# EAGLE schematic sd2_redraw (EAGLE 8.5.1)
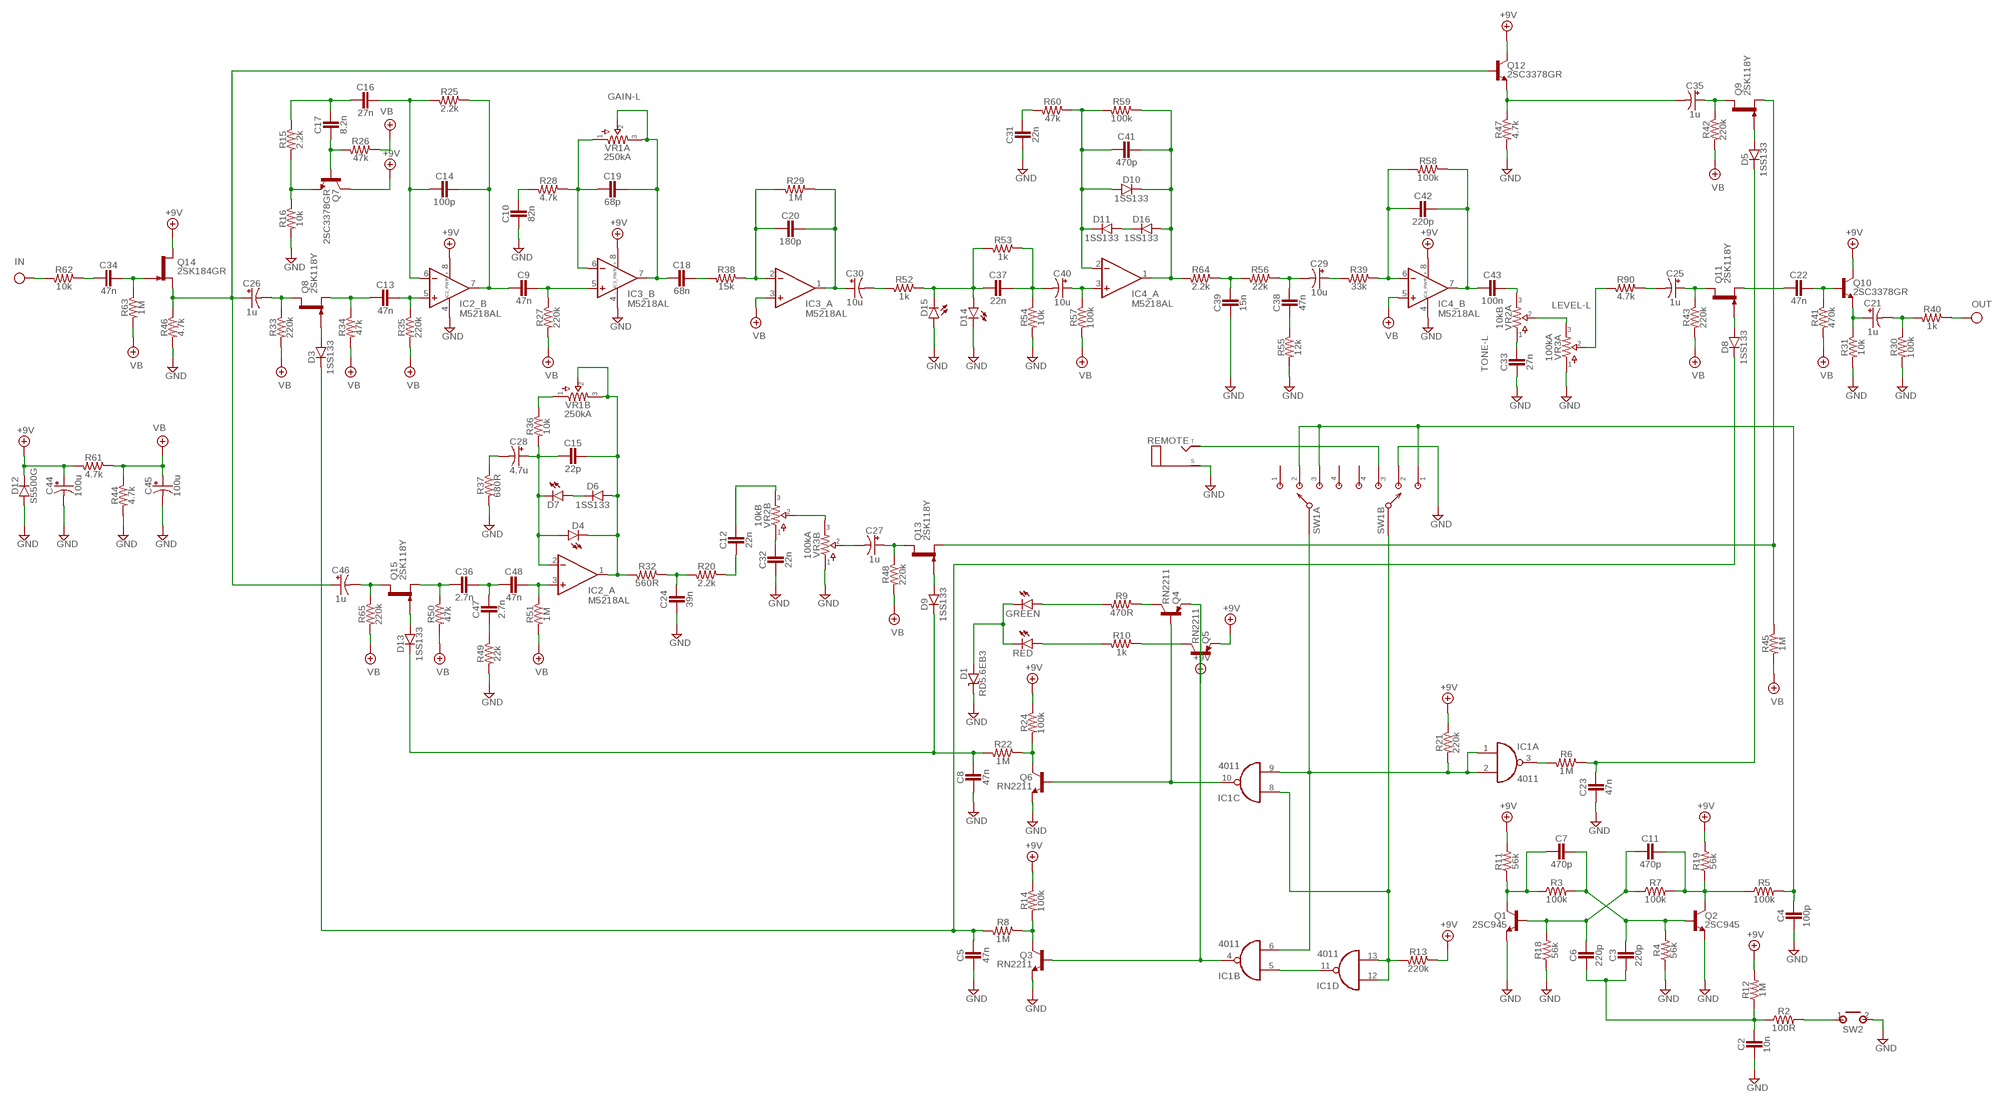
[diagram p0: schematic, sheet 1]

## Parts
C2  10n  CER/FILMBOX.1  [BOX_SMALL]
C3  220p  CER/FILMBOX.1  [BOX_SMALL]
C4  100p  CER/FILMBOX.1  [BOX_SMALL]
C5  47n  CER/FILMBOX.1  [BOX_SMALL]
C6  220p  CER/FILMBOX.1  [BOX_SMALL]
C7  470p  CER/FILMBOX.1  [BOX_SMALL]
C8  47n  CER/FILMBOX.1  [BOX_SMALL]
C9  47n  CER/FILMBOX.1  [BOX_SMALL]
C10  82n  CER/FILMBOX.1  [BOX_SMALL]
C11  470p  CER/FILMBOX.1  [BOX_SMALL]
C12  22n  CER/FILMBOX.1  [BOX_SMALL]
C13  47n  CER/FILMBOX.1  [BOX_SMALL]
C14  100p  CER/FILMBOX.1  [BOX_SMALL]
C15  22p  CER/FILMBOX.1  [BOX_SMALL]
C16  27n  CER/FILMBOX.1  [BOX_SMALL]
C17  8.2n  CER/FILMBOX.1  [BOX_SMALL]
C18  68n  CER/FILMBOX.1  [BOX_SMALL]
C19  68p  CER/FILMBOX.1  [BOX_SMALL]
C20  180p  CER/FILMBOX.1  [BOX_SMALL]
C21  1u  0400  [040_020]
C22  47n  CER/FILMBOX.1  [BOX_SMALL]
C23  47n  CER/FILMBOX.1  [BOX_SMALL]
C24  39n  CER/FILMBOX.1  [BOX_SMALL]
C25  1u  0400  [040_020]
C26  1u  0400  [040_020]
C27  1u  0400  [040_020]
C28  4.7u  0400  [040_020]
C29  10u  0400  [040_020]
C30  10u  0400  [040_020]
C31  22n  CER/FILMBOX.1  [BOX_SMALL]
C32  22n  CER/FILMBOX.1  [BOX_SMALL]
C33  27n  CER/FILMBOX.1  [BOX_SMALL]
C34  47n  CER/FILMBOX.1  [BOX_SMALL]
C35  1u  0400  [040_020]
C36  2.7n  CER/FILMBOX.1  [BOX_SMALL]
C37  22n  CER/FILMBOX.1  [BOX_SMALL]
C38  47n  CER/FILMBOX.1  [BOX_SMALL]
C39  15n  CER/FILMBOX.1  [BOX_SMALL]
C40  10u  0400  [040_020]
C41  470p  CER/FILMBOX.1  [BOX_SMALL]
C42  220p  CER/FILMBOX.1  [BOX_SMALL]
C43  100n  CER/FILMBOX.1  [BOX_SMALL]
C44  100u  0400  [040_020]
C45  100u  0400  [040_020]
C46  1u  0400  [040_020]
C47  2.7n  CER/FILMBOX.1  [BOX_SMALL]
C48  47n  CER/FILMBOX.1  [BOX_SMALL]
D1  RD5.6EB3  ZENER.2  [DO41-2]
D3  1SS133  DO35.2  [DO35-2]
D4  LED  [3MM_D]
D5  1SS133  DO35.2  [DO35-2]
D6  1SS133  DO35.2  [DO35-2]
D7  LED  [3MM_D]
D8  1SS133  DO35.2  [DO35-2]
D9  1SS133  DO35.2  [DO35-2]
D10  1SS133  DO35.2  [DO35-2]
D11  1SS133  DO35.2  [DO35-2]
D12  S5500G  DO35.2  [DO35-2]
D13  1SS133  DO35.2  [DO35-2]
D14  LED  [3MM_D]
D15  LED  [3MM_D]
D16  1SS133  DO35.2  [DO35-2]
GREEN  LED  [3MM_D]
IC1  4011  4011N  [DIL14]
IC2  M5218AL  DUALTH  [DIL0]
IC3  M5218AL  DUALTH  [DIL0]
IC4  M5218AL  DUALTH  [DIL0]
Q1  2SC945  2SC828A  [TO92-]
Q2  2SC945  2SC828A  [TO92-]
Q3  RN2211  2N3904  [TO92-]
Q4  RN2211  2N3906  [TO92]
Q5  RN2211  2N3906  [TO92]
Q6  RN2211  2N3904  [TO92-]
Q7  2SC3378GR  2N3904  [TO92-]
Q8  2SK118Y  2N5457  [TO92-]
Q9  2SK118Y  2N5457  [TO92-]
Q10  2SC3378GR  2N3904  [TO92-]
Q11  2SK118Y  2N5457  [TO92-]
Q12  2SC3378GR  2N3904  [TO92-]
Q13  2SK118Y  2N5457  [TO92-]
Q14  2SK184GR  2N5457  [TO92-]
Q15  2SK118Y  2N5457  [TO92-]
R2  100R  R_.3B  [R0207/3]
R3  100k  R_.3B  [R0207/3]
R4  56k  R_.3B  [R0207/3]
R5  100k  R_.3B  [R0207/3]
R6  1M  R_.3B  [R0207/3]
R7  100k  R_.3B  [R0207/3]
R8  1M  R_.3B  [R0207/3]
R9  470R  R_.3B  [R0207/3]
R10  1k  R_.3B  [R0207/3]
R11  56k  R_.3B  [R0207/3]
R12  1M  R_.3B  [R0207/3]
R13  220k  R_.3B  [R0207/3]
R14  100k  R_.3B  [R0207/3]
R15  2.2k  R_.3B  [R0207/3]
R16  10k  R_.3B  [R0207/3]
R18  56k  R_.3B  [R0207/3]
R19  56k  R_.3B  [R0207/3]
R20  2.2k  R_.3B  [R0207/3]
R21  220k  R_.3B  [R0207/3]
R22  1M  R_.3B  [R0207/3]
R24  100k  R_.3B  [R0207/3]
R25  2.2k  R_.3B  [R0207/3]
R26  47k  R_.3B  [R0207/3]
R27  220k  R_.3B  [R0207/3]
R28  4.7k  R_.3B  [R0207/3]
R29  1M  R_.3B  [R0207/3]
R30  100k  R_.3B  [R0207/3]
R31  10k  R_.3B  [R0207/3]
R32  560R  R_.3B  [R0207/3]
R33  220k  R_.3B  [R0207/3]
R34  47k  R_.3B  [R0207/3]
R35  220k  R_.3B  [R0207/3]
R36  10k  R_.3B  [R0207/3]
R37  680R  R_.3B  [R0207/3]
R38  15k  R_.3B  [R0207/3]
R39  33k  R_.3B  [R0207/3]
R40  1k  R_.3B  [R0207/3]
R41  470k  R_.3B  [R0207/3]
R42  220k  R_.3B  [R0207/3]
R43  220k  R_.3B  [R0207/3]
R44  4.7k  R_.3B  [R0207/3]
R45  1M  R_.3B  [R0207/3]
R46  4.7k  R_.3B  [R0207/3]
R47  4.7k  R_.3B  [R0207/3]
R48  220k  R_.3B  [R0207/3]
R49  22k  R_.3B  [R0207/3]
R50  47k  R_.3B  [R0207/3]
R51  1M  R_.3B  [R0207/3]
R52  1k  R_.3B  [R0207/3]
R53  1k  R_.3B  [R0207/3]
R54  10k  R_.3B  [R0207/3]
R55  12k  R_.3B  [R0207/3]
R56  22k  R_.3B  [R0207/3]
R57  100k  R_.3B  [R0207/3]
R58  100k  R_.3B  [R0207/3]
R59  100k  R_.3B  [R0207/3]
R60  47k  R_.3B  [R0207/3]
R61  4.7k  R_.3B  [R0207/3]
R62  10k  R_.3B  [R0207/3]
R63  1M  R_.3B  [R0207/3]
R64  2.2k  R_.3B  [R0207/3]
R65  220k  R_.3B  [R0207/3]
R90  4.7k  R_.3B  [R0207/3]
RED  LED  [3MM_D]
REMOTE  MONO  [TWO_PADS]
SW1  2P4T  [SMALLROTARY]
SW2  MOMENTARY  [SPST]
VR1A  250kA  POTS16MM  [16MM]
VR1B  250kA  POTS16MM  [16MM]
VR2A  10kB  POTS16MM  [16MM]
VR2B  10kB  POTS16MM  [16MM]
VR3A  100kA  POTS16MM  [16MM]
VR3B  100kA  POTS16MM  [16MM]

## Nets
+9V: C44.+ D12.C IC2.8(_PWR:V+) IC3.8(_PWR:V+) IC4.8(_PWR:V+) Q4.3(E) Q5.3(E) Q7.1(C) Q10.1(C) Q12.1(C) Q14.3(D) R11.2 R12.2 R13.1 R14.1 R19.2 R21.1 R24.1 R61.2
GND: C2.2 C4.2 C5.2 C8.2 C10.2 C23.2 C24.2 C31.2 C32.2 C33.2 C39.2 C44.- C45.- D1.C D12.A D14.P$1(C) D15.ANODE(A) IC2.4(_PWR:V-) IC3.4(_PWR:V-) IC4.4(_PWR:V-) Q1.3(E) Q2.3(E) Q3.3(E) Q6.3(E) R4.1 R16.2 R18.1 R30.2 R31.2 R37.2 R44.2 R46.2 R47.2 R49.2 R54.2 R55.2 REMOTE.S(SLEEVE) SW1.6 SW2.2(S) VR3A.1 VR3B.1
IN: R62.2
N$1: C27.- VR3B.2
N$2: D6.C D7.ANODE(A)
N$3: C34.2 R62.1
N$4: C34.1 Q14.1(G) R63.1
N$5: C26.+ C46.+ Q12.2(B) Q14.2(S) R46.1
N$6: C26.- Q8.3(D) R33.1
N$7: D3.A Q8.1(G)
N$8: C13.2 Q8.2(S) R34.1
N$9: C13.1 IC2.5(_B:+IN) R35.1
N$10: C14.2 C16.1 IC2.6(_B:-IN) R25.2
N$11: C9.2 C14.1 IC2.7(_B:OUT) R25.1
N$12: Q7.3(E) R15.2 R16.1
N$13: C9.1 IC3.5(_B:+IN) R27.1
N$14: C17.2 Q7.2(B) R26.2
N$15: C10.1 R28.2
N$16: C16.2 C17.1 R15.1
N$17: IC1.10(C:O) Q4.2(B) Q6.2(B)
N$19: C18.1 R38.2
N$20: C20.2 IC3.2(_A:-IN) R29.2 R38.1
N$21: C20.1 C30.+ IC3.1(_A:OUT) R29.1
N$22: C30.- R52.2
N$23: C37.2 D14.ANODE(A) D15.P$1(C) R52.1 R53.2
N$24: C37.1 C40.- R53.1 R54.1
N$25: C40.+ IC4.3(_A:+IN) R57.1
N$26: C41.2 D10.A D11.C IC4.2(_A:-IN) R59.2 R60.1
N$28: C41.1 D10.C D16.A IC4.1(_A:OUT) R59.1 R64.2
N$29: C7.2 Q1.2(C) R3.1 R11.1
N$30: D11.A D16.C
N$31: C11.1 Q2.2(C) R5.1 R7.2 R19.1
N$32: C6.1 C11.2 Q1.1(B) R7.1 R18.2
N$33: C31.1 R60.2
N$34: C3.1 C7.1 Q2.1(B) R3.2 R4.2
N$35: C2.1 C3.2 C6.2 R2.1 R12.1
N$36: C39.1 R56.2 R64.1
N$37: C29.- C38.1 R56.1
N$38: C38.2 R55.1
N$39: C29.+ R39.2
N$40: C42.2 IC4.6(_B:-IN) R39.1 R58.2
N$41: C43.1 VR2A.3
N$42: C42.1 C43.2 IC4.7(_B:OUT) R58.1
N$43: C33.1 VR2A.1
N$44: VR2A.2 VR3A.3
N$45: R90.2 VR3A.2
N$46: C25.- R90.1
N$47: C25.+ Q11.3(D) R43.1
N$48: D8.A Q11.1(G)
N$49: C35.+ Q9.3(D) R42.1
N$50: D5.A Q9.1(G)
N$51: C35.- Q12.3(E) R47.1
N$52: C46.- Q15.3(D) R65.1
N$53: C36.2 Q15.2(S) R50.1
N$54: D13.A Q15.1(G)
N$55: C36.1 C47.1 C48.2
N$56: C47.2 R49.1
N$57: C48.1 IC2.3(_A:+IN) R51.1
N$58: C15.2 C28.+ D4.ANODE(A) D7.P$1(C) IC2.2(_A:-IN) R36.2
N$59: R36.1 VR1B.1
N$60: C15.1 D4.P$1(C) D6.A IC2.1(_A:OUT) R32.2 VR1B.2 VR1B.3
N$61: C24.1 R20.2 R32.1
N$62: C28.- R37.1
N$63: C12.2 R20.1
N$64: C12.1 VR2B.3
N$65: C32.1 VR2B.1
N$66: VR2B.2 VR3B.3
N$68: C27.+ Q13.3(D) R48.1
N$69: D9.A Q13.1(G)
N$71: Q3.1(C) R8.1 R14.2
N$72: Q5.1(C) R10.1
N$73: Q4.1(C) R9.1
N$74: GREEN.ANODE(A) R9.2
N$75: R10.2 RED.ANODE(A)
N$76: D1.A GREEN.P$1(C) RED.P$1(C)
N$77: Q6.1(C) R22.1 R24.2
N$78: C8.1 D9.C D13.C R22.2
N$79: C5.1 D3.C D8.C R8.2
N$80: IC1.4(B:O) Q3.2(B) Q5.2(B)
N$81: Q9.2(S) Q13.2(S) R45.1
N$82: IC1.1(A:I0) IC1.2(A:I1) IC1.6(B:I1) IC1.9(C:I1) R21.2 SW1.C(A:A)
N$83: IC1.5(B:I0) IC1.11(D:O)
N$84: IC1.8(C:I0) IC1.12(D:I0) IC1.13(D:I1) R13.2 SW1.9(B:A)
N$85: R2.2 SW2.1(P)
N$86: C22.2 Q11.2(S)
N$87: IC1.3(A:O) R6.2
N$88: C23.1 D5.C R6.1
N$89: REMOTE.T(TIP) SW1.7
N$90: C22.1 Q10.2(B) R41.1
N$91: C4.1 R5.2 SW1.2 SW1.3 SW1.5
N$92: C21.+ Q10.3(E) R31.1
N$93: C21.- R30.1 R40.2
N$95: C19.2 IC3.6(_B:-IN) R28.1 VR1A.1
N$96: C18.2 C19.1 IC3.7(_B:OUT) VR1A.2 VR1A.3
OUT: R40.1
VB: C45.+ IC3.3(_A:+IN) IC4.5(_B:+IN) R26.1 R27.2 R33.2 R34.2 R35.2 R41.2 R42.2 R43.2 R44.1 R45.2 R48.2 R50.2 R51.2 R57.2 R61.1 R63.2 R65.2
Unconnected: SW1.1 SW1.4 SW1.8

## Notes on the sheet
- GAIN-L
- LEVEL-L
- TONE-L

## Power pins joined to a net without a drawn wire
VDD: IC1.14(P:VDD)
VSS: IC1.7(P:VSS)

## Library data of the parts
C2-C20 C22-C24 C31-C34 C36-C39 C41-C43 C47 C48 = pedals-capacitors-film:CER/FILM: 47 - 120pF Xicon Ceramic Disc 2.5mm lead spacing
C21 C25-C30 C35 C40 C44-C46 = pedals-capacitors-elec:040
D1 = pedals-diodes:ZENER
D3 D5 D6 D8-D13 D16 = pedals-diodes:DO35: DO-35 Package Diodes: 1N914
D4 D7 D14 D15 GREEN RED = pedals-diodes:LED
IC1 = pedals-40xx-2:4011: Quad 2-input NAND
IC2-IC4 = pedals-integrated circuits:DUAL: OP AMP
Q1 Q2 = pedals-transistors:2SC828A
Q3 Q6 Q7 Q10 Q12 = pedals-transistors:2N3904: NPN Transistor
Q4 Q5 = pedals-transistors:2N3906: PNP Transistor
Q8 Q9 Q11 Q13-Q15 = pedals-transistors:2N5457: N-CHANNEL JFET
R2-R16 R18-R22 R24-R65 R90 = pedals-resistors:R_
REMOTE = pedals-jacks:MONO: Mono 1/4" Phone Jack
SW1 = pedals-switches:2P4T
SW2 = pedals-switches:MOMENTARY
VR1A VR1B VR2A VR2B VR3A VR3B = pedals-potentiometers:POTS